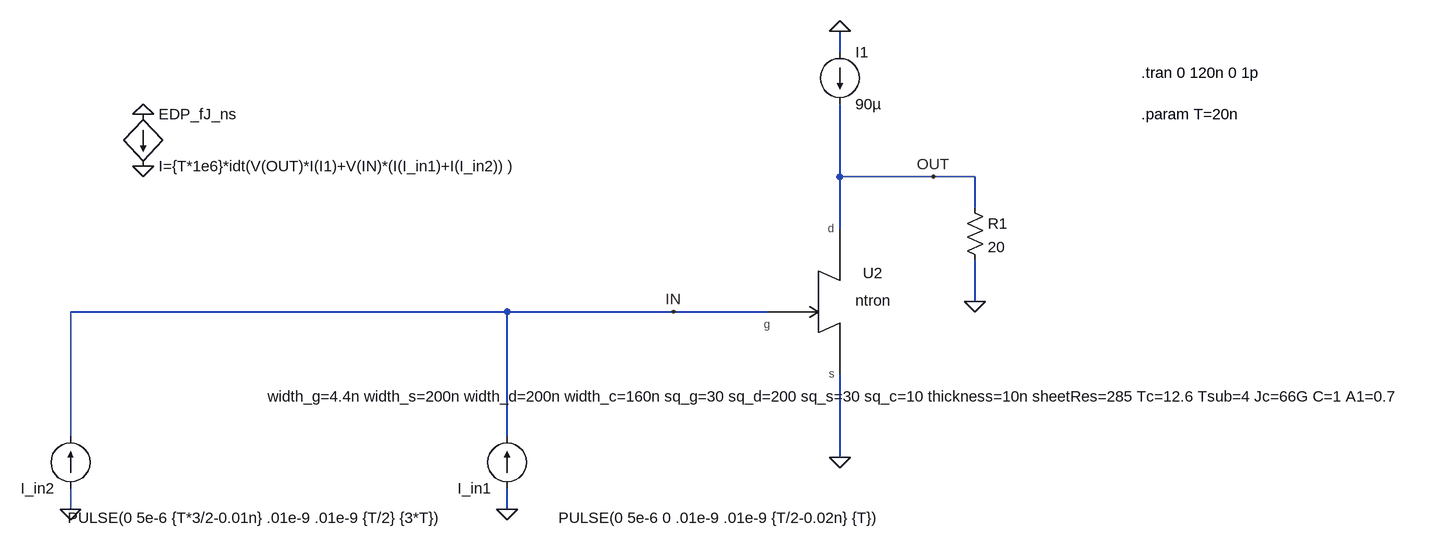
[diagram p0: schematic ntron_EDP_test.asc]
ntron_EDP_test.asc, the LTspice schematic file:
Version 4
SHEET 1 2180 756
WIRE 256 -224 256 -256
WIRE 256 -32 256 -144
WIRE 400 -32 256 -32
WIRE 464 -32 400 -32
WIRE 464 16 464 -32
WIRE 256 48 256 -32
WIRE 464 160 464 96
WIRE -256 176 -928 176
WIRE 0 176 -256 176
WIRE 144 176 0 176
WIRE -928 368 -928 176
WIRE -256 368 -256 176
WIRE 256 400 256 272
WIRE -928 480 -928 448
WIRE -256 480 -256 448
FLAG 256 400 0
FLAG 464 160 0
FLAG -256 480 0
FLAG 256 -256 0
FLAG -816 -48 0
FLAG -816 -128 0
FLAG 0 176 IN
FLAG 400 -32 OUT
FLAG -928 480 0
SYMBOL res 448 0 R0
SYMATTR InstName R1
SYMATTR Value 20
SYMBOL current -256 448 R180
WINDOW 3 -580 -45 Left 2
WINDOW 123 0 0 Left 2
WINDOW 39 0 0 Left 2
SYMATTR Value PULSE(0 5e-6 0 .01e-9 .01e-9 {T/2-0.02n} {T})
SYMATTR InstName I_in1
SYMBOL current 256 -224 R0
WINDOW 123 0 0 Left 0
WINDOW 39 0 0 Left 0
SYMATTR InstName I1
SYMATTR Value 90µ
SYMBOL bi -816 -128 R0
SYMATTR InstName EDP_fJ_ns
SYMATTR Value I={T*1e6}*idt(V(OUT)*I(I1)+V(IN)*(I(I_in1)+I(I_in2)) )
SYMBOL current -928 448 R180
WINDOW 3 -580 -45 Left 2
WINDOW 123 0 0 Left 2
WINDOW 39 0 0 Left 2
SYMATTR Value PULSE(0 5e-6 {T*3/2-0.01n} .01e-9 .01e-9 {T/2} {3*T})
SYMATTR InstName I_in2
SYMBOL ntron 256 160 R0
SYMATTR InstName U2
SYMATTR SpiceLine width_g=4.4n width_s=200n width_d=200n width_c=160n sq_g=30 sq_d=200 sq_s=30 sq_c=10 thickness=10n sheetRes=285 Tc=12.6 Tsub=4 Jc=66G C=1 A1=0.7
TEXT 720 -192 Left 2 !.tran 0 120n 0 1p
TEXT 720 -128 Left 2 !.param T=20n

The netlist it stands for:
* ntron_EDP_test.asc
R1 OUT 0 20
I_in1 0 IN PULSE(0 5e-6 0 .01e-9 .01e-9 {T/2-0.02n} {T})
I1 0 OUT 90µ
B§EDP_fJ_ns 0 0 I={T*1e6}*idt(V(OUT)*I(I1)+V(IN)*(I(I_in1)+I(I_in2)) )
I_in2 0 IN PULSE(0 5e-6 {T*3/2-0.01n} .01e-9 .01e-9 {T/2} {3*T})
XU2 IN OUT 0 ntron width_g=4.4n width_s=200n width_d=200n width_c=160n sq_g=30 sq_d=200 sq_s=30 sq_c=10 thickness=10n sheetRes=285 Tc=12.6 Tsub=4 Jc=66G C=1 A1=0.7  ; pins g d s
.tran 0 120n 0 1p
.param T=20n
.lib ntron.lib
.backanno
.end